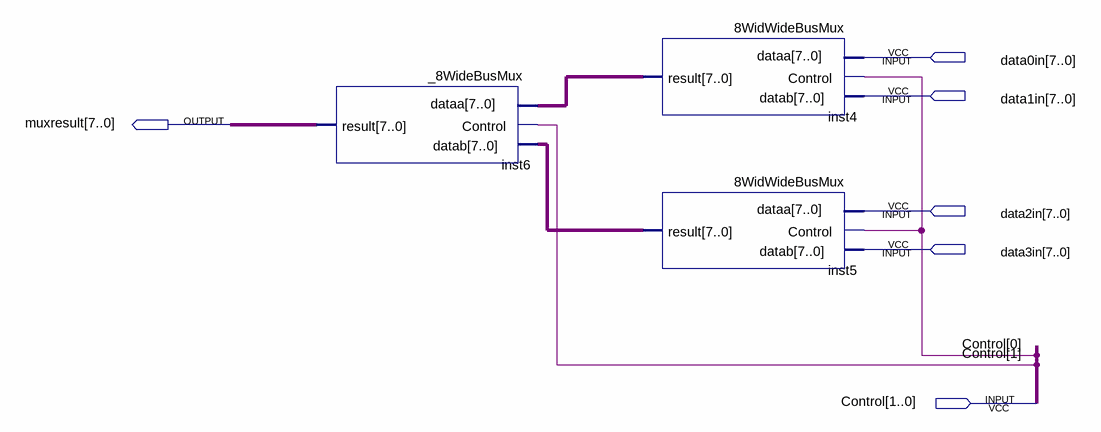
[diagram p0: schematic sheet]
// Quartus schematic 8wide4to1BusMUX.bdf as structural Verilog: 3 symbols, 6 pins
module \8wide4to1BusMUX  (
  input  [7:0] data0in,
  input  [7:0] data1in,
  input  [7:0] data2in,
  input  [7:0] data3in,
  input  [1:0] Control,
  output [7:0] muxresult
);

  wire [7:0] inst4_result, inst5_result;

  _8WideBusMux inst6 (.Control(Control[1]), .dataa(inst4_result), .datab(inst5_result), .result(muxresult));
  \8WidWideBusMux  inst4 (.Control(Control[0]), .dataa(data0in), .datab(data1in), .result(inst4_result));
  \8WidWideBusMux  inst5 (.Control(Control[0]), .dataa(data2in), .datab(data3in), .result(inst5_result));
endmodule
